# EasyEDA schematic SCH_Stepper-Relay-V2_2024-11-13.json
TITLE: Stepper/Relay Circuit; REV: 1.0; Date: 2023-02-06; Sheet: 1/1; Drawn By: waj2; Company: HSL
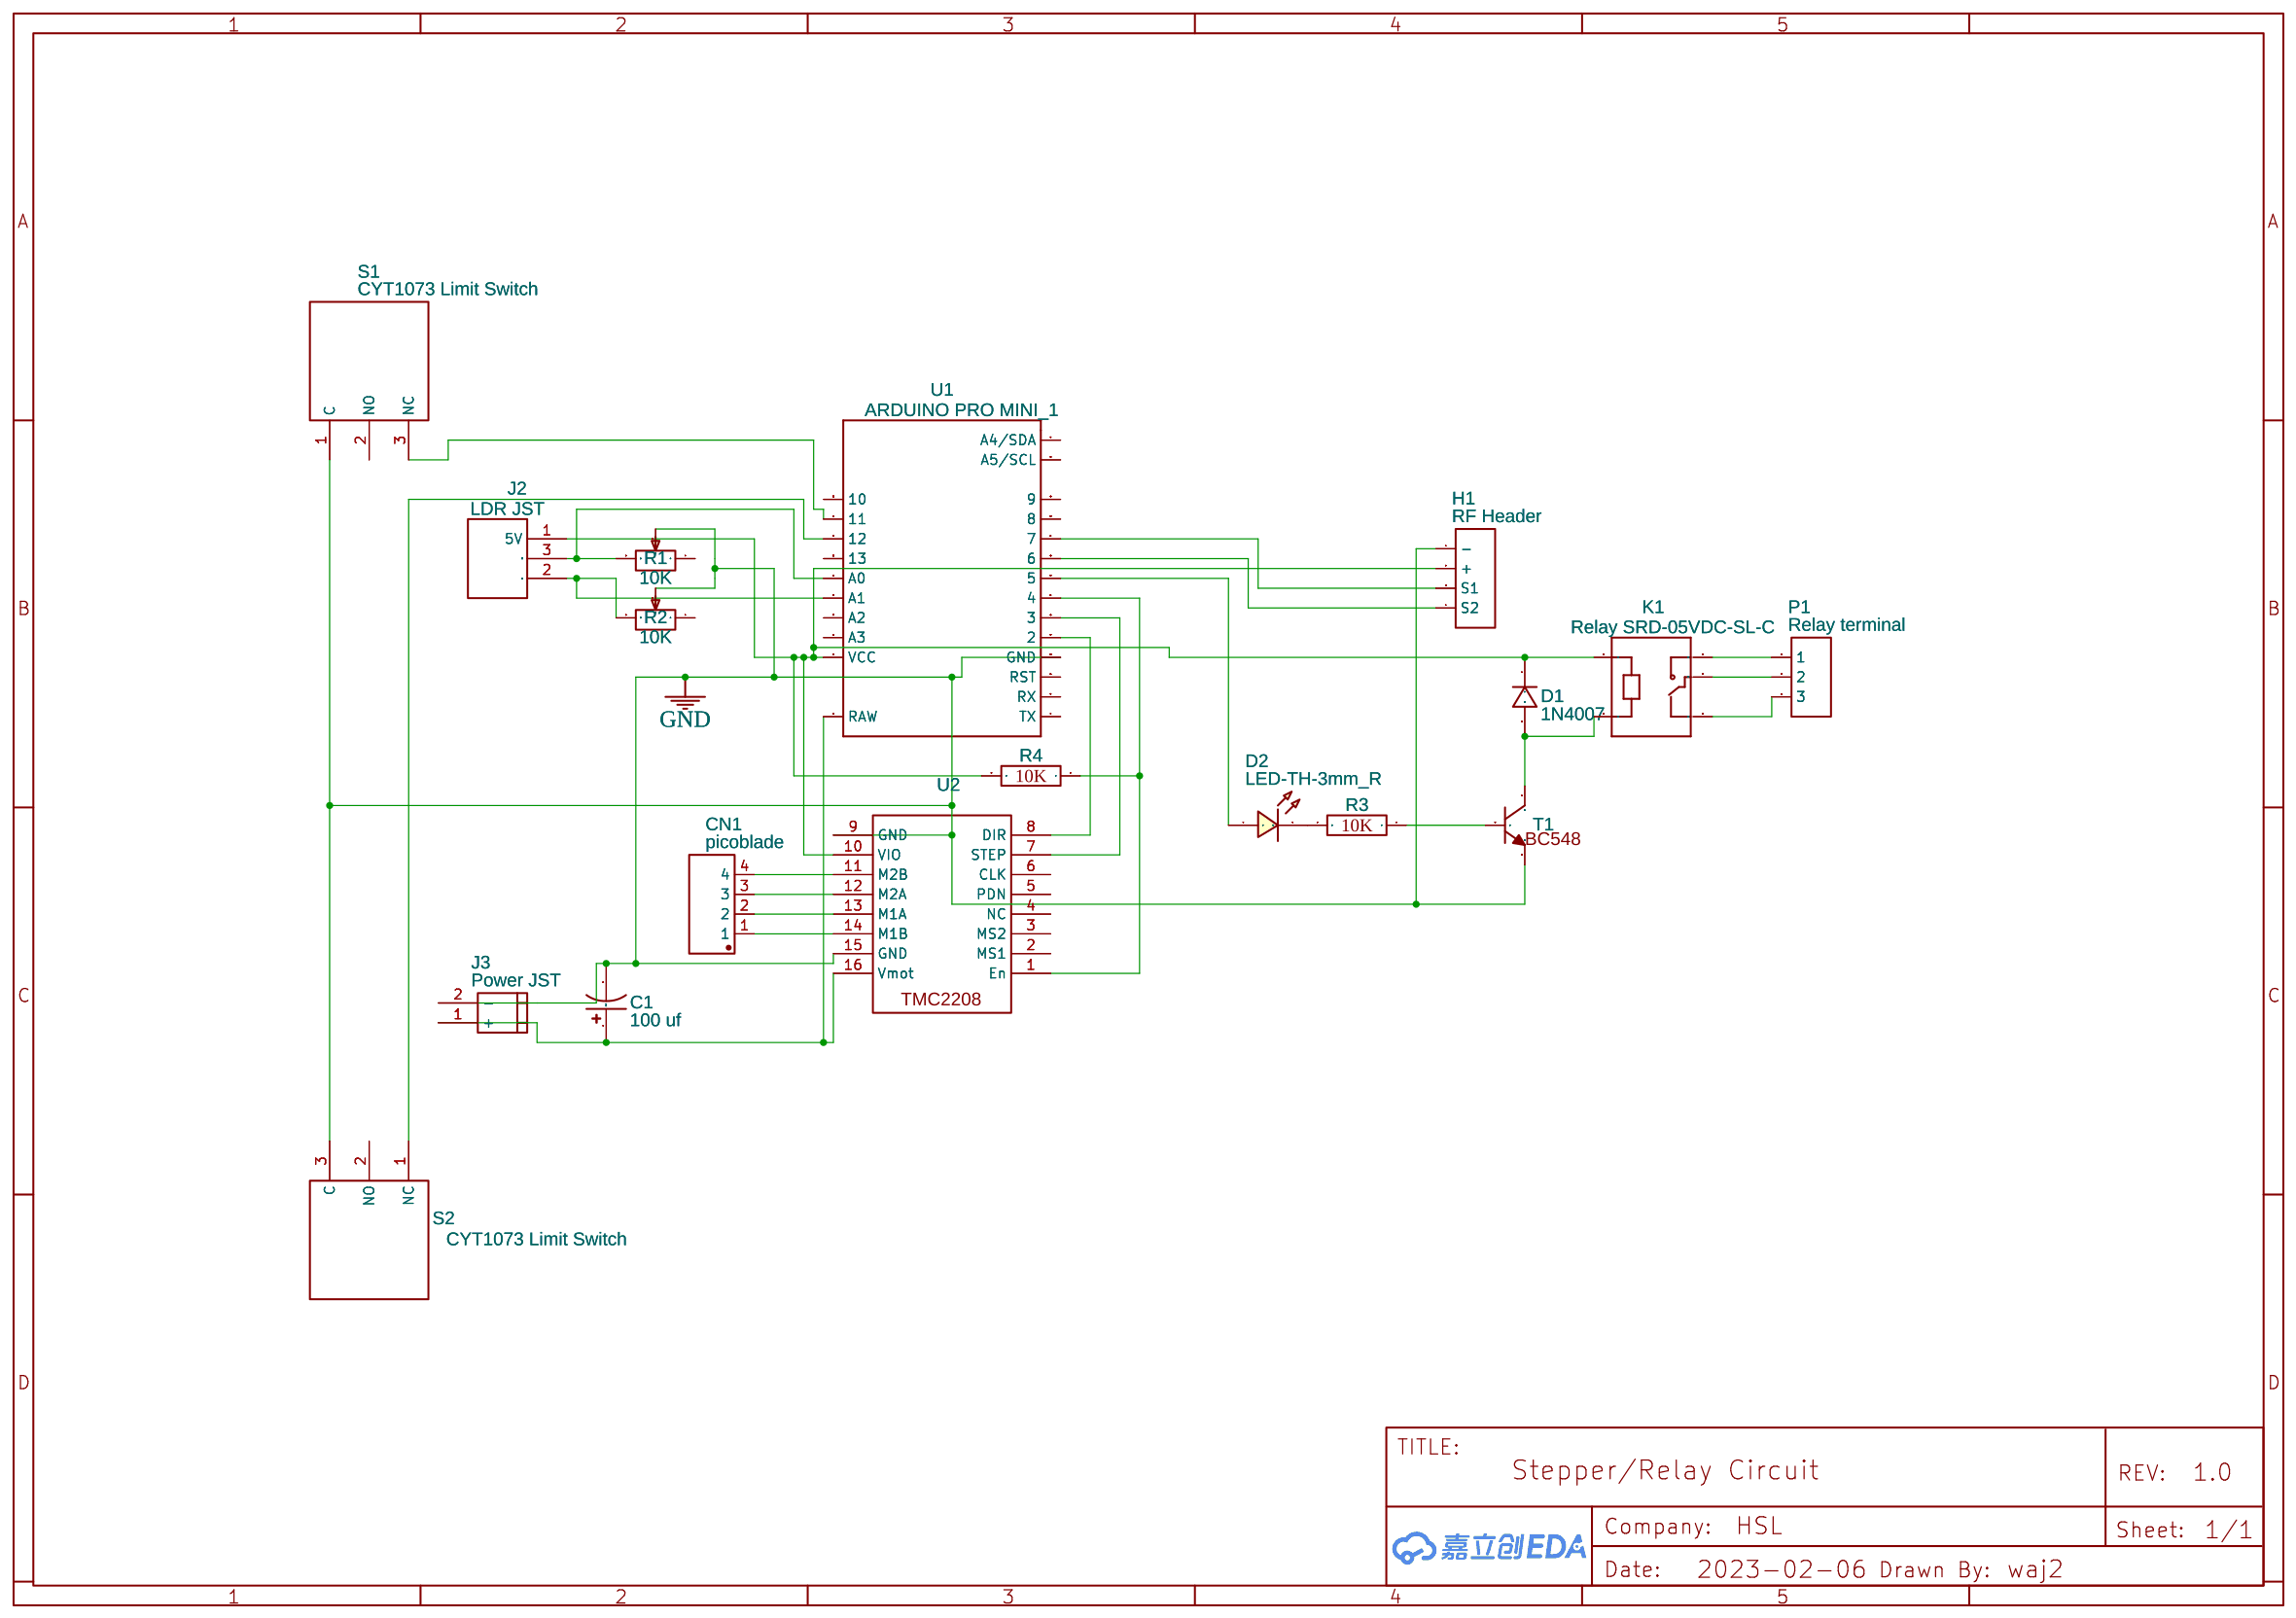
[diagram p0: schematic sheet]

## Parts
C1  100 uf  [CAP-D6.3×F2.5]
CN1  picoblade  [MOLEX_0530470410]
D1  1N4007  [DO-41_BD2.4-L4.7-P8.70-D0.9-RD]
D2  LED-TH-3mm_R  [LED-TH_BD3.0_RED]
H1  RF Header  [HDR-F-2.54_1X4]
J2  LDR JST  [JST-HX 3P RIGHT ANGLE]
J3  Power JST  [JST-XH-2PIN]
K1  Relay SRD-05VDC-SL-C  [SRD-05VDC-SL-C_RELAY_SRD-05VDC-SL-C]
P1  Relay terminal  [CONN-TH_3P-P5.00]
R1  10K  [RM065-V1]
R2  10K  [RM065-V1]
R3  RESISTOR 10K  [RESISTOR 10K]
R4  RESISTOR 10K  [RESISTOR 10K]
S1  CYT1073 Limit Switch  [CYT1073]
S2  CYT1073 Limit Switch  [CYT1073]
T1  BC548  [BC548]
U1  ARDUINO PRO MINI_1  [ARDUINOPROMINI_ARDUINO_PRO_MINI_1]
U2  U2  [TMC2208V1.0]

## Library data of the parts
C1 = CE_TH_D6.3×F2.5_US: Contributor: LCEDA_Lib
CN1 = MOLEX_0530470410: Supplier: RS-Online; Manufacturer: MOLEX; Manufacturer Part: 0530474310; Contributor: The_Doogy; Supplier Part: 279-9229; link: https://www.molex.com/molex/products/part-detail/pcb_headers/0530470410
D1 = 1N4007: Supplier: LCSC; Manufacturer: SEMTECH; Supplier Part: C106903; Contributor: LCEDA_Lib
D2 = LED-TH-3mm_R: Manufacturer: EVERLIGHT(台湾亿光); Manufacturer Part: 204-10SDRD/S530-A3-L; Supplier Part: C84774; Supplier: LCSC; Contributor: LCEDA_Lib
H1 = HDR-F-2.54_1x4: Supplier Part: C225501; Supplier: LCSC; Contributor: LCEDA_Lib
J2 = JST-HX 3P RIGHT ANGLE COPY: Manufacturer Part: JST-5-PTH; Contributor: dreAn
J3 = XH-2PWB: Supplier Part: C64520; Supplier: LCSC; Manufacturer: ReliaPro
K1 = SRD-05VDC-SL-C_SRD-05VDC-SL-C: Contributor: ismailsurek
P1 = CONN-TH_3P-P5.00: Supplier: LCSC; Contributor: LCEDA_Lib
R1 R2 = TRIMPOT RM065: Manufacturer: ReliaPro; Manufacturer Part: RM065-V1-5K blue; Supplier Part: C36862; Contributor: magneto
R3 R4 = RESISTOR 10K: Supplier Part: undefined; Contributor: pritams07
S1 S2 = CYT1073 Limit Switch: Manufacturer: Cylewet; Manufacturer Part: Cylewet; Supplier: Amazon; link: https://www.amazon.com/Cylewet-25Pcs-Switch-Arduino-CYT1073/dp/B073TYWX86/ref=sr_1_1_sspa?dchild=1&keywords=small+limit+switch&qid=1617126824&sr=8-1-spons&psc=1&spLa=ZW5jcnlwdGVkUXVhbGlmaWVyPUExRkdXWlNRMU9BWktIJmVuY3J5cHRlZElkPUEwMjIwNjM4MjgxOEI3NzkxSTNJOSZlbmNyeXB0ZWRBZElkPUEwNzczODkyQVRESlU3S1JaS0syJndpZGdldE5hbWU9c3BfYXRmJmFjdGlvbj1jbGlja1JlZGlyZWN0JmRvTm90TG9nQ2xpY2s9dHJ1ZQ; Contributor: benjamin.cheek8
T1 = BC548: Contributor: hiranjyoti
U1 = ARDUINO PRO MINI_1: Arduino Pro Mini footprint; Contributor: virgonia; Package Display: No
U2 = ТМС2208v1.0: Supplier: CHINA; Contributor: Simbiot Black

## Nets
GND: C1.2 H1.1(-) J3.2(-) R1.2 R2.2 S1.1(C) S2.3(C) T1.3(E) U1.GND U2.9(GND) U2.15(GND)
Net-(C1-1): C1.1 J3.1(+) U1.RAW U2.16(Vmot)
Net-(CN1-1): CN1.1 U2.14(M1B)
Net-(CN1-2): CN1.2 U2.13(M1A)
Net-(CN1-3): CN1.3 U2.12(M2A)
Net-(CN1-4): CN1.4 U2.11(M2B)
Net-(D1-1): D1.1 H1.2(+) J2.1(5V) K1.A1 R4.2 U1.VCC U2.10(VIO)
Net-(D1-2): D1.2 K1.A2 T1.1(C)
Net-(D2-1): D2.1 U1.D5(5)
Net-(D2-2): D2.2 R3.2
Net-(H1-3): H1.3(S1) U1.D7(7)
Net-(H1-4): H1.4(S2) U1.D6(6)
Net-(J2-2): J2.2(S1) R2.3 U1.A1
Net-(J2-3): J2.3(S2) R1.3 U1.A0
Net-(K1-COM): K1.COM P1.2
Net-(K1-NC): K1.NC P1.3
Net-(K1-NO): K1.NO P1.1
Net-(R3-1): R3.1 T1.2(B)
Net-(R4-1): R4.1 U1.D4(4) U2.1(En)
Net-(S1-3): S1.3(NC) U1.D11(11)
Net-(S2-1): S2.1(NC) U1.D12(12)
Net-(U1-D2): U1.D2(2) U2.8(DIR)
Net-(U1-D3): U1.D3(3) U2.7(STEP)

Not connected (* = marked no-connect by the designer): R1 1; R2 1; S1 2(NO); S2 2(NO); U1 A2 A3 A4(A4/SDA) A5(A5/SCL) D8(8) D9(9) D10(10) D13(13) RST RX TX; U2 2(MS1) 3(MS2) 4(NC) 5(PDN) 6(CLK)
